# EAGLE design power_NAND_2input (EAGLE 8.6.3)
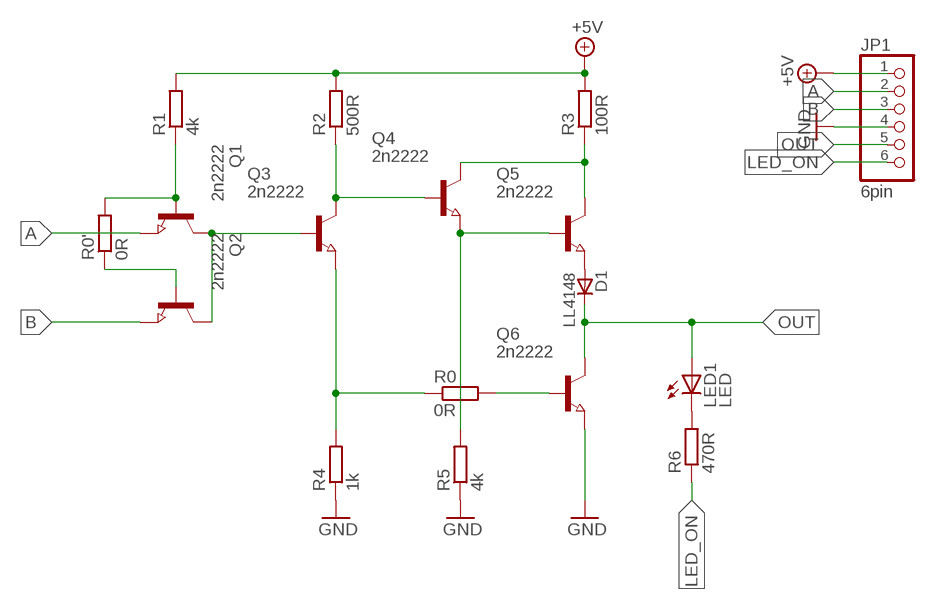
[diagram p0: schematic, sheet 1]

## Parts
D1  LL4148  [SOD80_DO213AA_MINIMELF]
JP1  6pin  PINHD-1X06_2.54-SMD-90°  [1X06SMD/90]
LED1  LED  LEDCHIPLED_0805  [CHIPLED_0805]
Q1  2n2222  NPN-TRANSISTOR_SOT23  [SOT23]
Q2  2n2222  NPN-TRANSISTOR_SOT23  [SOT23]
Q3  2n2222  NPN-TRANSISTOR_SOT23  [SOT23]
Q4  2n2222  NPN-TRANSISTOR_SOT23  [SOT23]
Q5  2n2222  NPN-TRANSISTOR_SOT23  [SOT23]
Q6  2n2222  NPN-TRANSISTOR_SOT23  [SOT23]
R0  0R  R-EU_R1206  [R1206]
R0'  0R  R-EU_R1206  [R1206]
R1  4k  R-EU_R0805  [R0805]
R2  500R  R-EU_R0805  [R0805]
R3  100R  R-EU_R0805  [R0805]
R4  1k  R-EU_R0805  [R0805]
R5  4k  R-EU_R0805  [R0805]
R6  470R  R-EU_R0805  [R0805]

## Nets
+5V: JP1.1 R1.2 R2.2 R3.2
A: JP1.2 Q1.2(E)
B: JP1.3 Q2.2(E)
GND: JP1.4 Q6.2(E) R4.1 R5.1
LED_ON: JP1.6 R6.1
N$1: Q1.3(C) Q2.3(C) Q3.1(B)
N$2: Q1.1(B) R0'.2 R1.1
N$3: Q3.3(C) Q4.1(B) R2.1
N$4: Q3.2(E) R0.1 R4.2
N$5: Q4.3(C) Q5.3(C) R3.1
N$6: Q4.2(E) Q5.1(B) R5.2
N$7: D1.A Q5.2(E)
N$8: Q2.1(B) R0'.1
N$10: LED1.C R6.2
N$11: Q6.1(B) R0.2
OUT: D1.C JP1.5 LED1.A Q6.3(C)

## Library data of the parts
D1 = _hhn_diodes_smd:LL4148: 1N4148 General Purpose Rectifie SMD-Version of 1N4148 Case: SOD 80 = DO 213 AA = MINIMELF (Glass) Author: Dipl.-Ing. FH Rainer Bayer HHN Hochschule Heilbronn, rainer.bayer@hs-heilbronn.de Ingenieurbüro ing-rb, mail@ing-rb.de
JP1 = pinhead-2:PINHD-1X06: PIN HEADER
LED1 = led:LED: LED OSRAM: - CHIPLED LG R971, LG N971, LY N971, LG Q971, LY Q971, LO R971, LY R971 LH N974, LH R974 LS Q976, LO Q976, LY Q976 LO Q996 - Hyper CHIPLED LW Q18S LB Q993, LB Q99A, LB R99A - SideLED LS A670, LO A670, LY A670, LG A670, LP A670 LB A673, LV A673, LT A673, LW A673 LH A674 LY A675 LS A676, LA A676, LO A676, LY A676, LW A676 LS A679, LY A679, LG A679 - Hyper Micro SIDELED® LS Y876, LA Y876, LO Y876, LY Y876 LT Y87S - SmartLED LW L88C, LW L88S LB L89C, LB L89S, LG L890 LS L89K, LO L89K, LY L89K LS L896, LA L896, LO L896, LY L896 - TOPLED LS T670, LO T670, LY T670, LG T670, LP T670 LSG T670, LSP T670, LSY T670, LOP T670, LYG T670 LG T671, LOG T671, LSG T671 LB T673, LV T673, LT T673, LW T673 LH T674 LS T676, LA T676, LO T676, LY T676, LB T676, LH T676, LSB T676, LW T676 LB T67C, LV T67C, LT T67C, LS T67K, LO T67K, LY T67K, LW E67C LS E67B, LA E67B, LO E67B, LY E67B, LB E67C, LV E67C, LT E67C LW T67C LS T679, LY T679, LG T679 LS T770, LO T770, LY T770, LG T770, LP T770 LB T773, LV T773, LT T773, LW T773 LH T774 LS E675, LA E675, LY E675, LS T675 LS T776, LA T776, LO T776, LY T776, LB T776 LHGB T686 LT T68C, LB T68C - Hyper Mini TOPLED® LB M676 - Mini TOPLED Santana® LG M470 LS M47K, LO M47K, LY M47K Source: http://www.osram.convergy.de LUXEON: - LUMILED® LXK2-PW12-R00, LXK2-PW12-S00, LXK2-PW14-U00, LXK2-PW14-V00 LXK2-PM12-R00, LXK2-PM12-S00, LXK2-PM14-U00 LXK2-PE12-Q00, LXK2-PE12-R00, LXK2-PE12-S00, LXK2-PE14-T00, LXK2-PE14-U00 LXK2-PB12-K00, LXK2-PB12-L00, LXK2-PB12-M00, LXK2-PB14-N00, LXK2-PB14-P00, LXK2-PB14-Q00 LXK2-PR12-L00, LXK2-PR12-M00, LXK2-PR14-Q00, LXK2-PR14-R00 LXK2-PD12-Q00, LXK2-PD12-R00, LXK2-PD12-S00 LXK2-PH12-R00, LXK2-PH12-S00 LXK2-PL12-P00, LXK2-PL12-Q00, LXK2-PL12-R00 Source: www.luxeon.com KINGBRIGHT: KA-3528ASYC Source: www.kingbright.com
Q1-Q6 = semicon-smd-ipc:NPN-TRANSISTOR_: NPN TRANSISTOR
R0 R0' R1-R6 = rcl:R-EU_: RESISTOR, European symbol; SPICEPREFIX: R

## Board
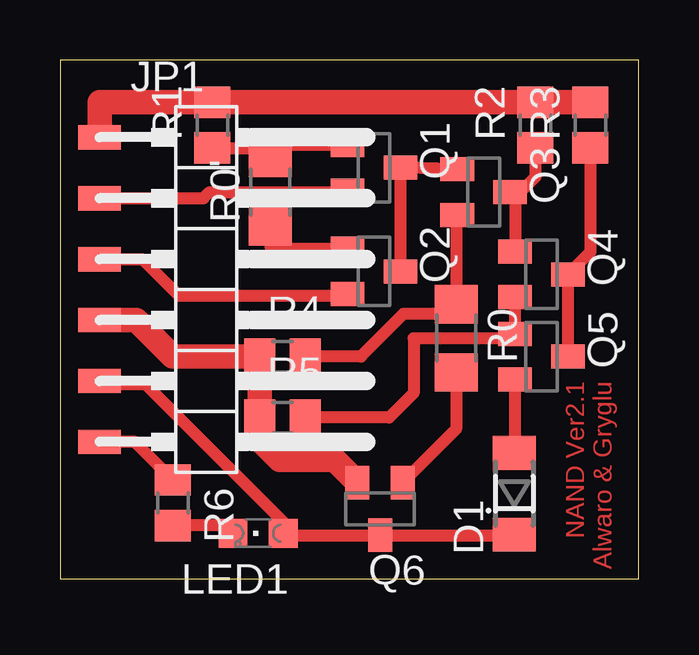
[diagram p1: board, top side]

Size 24.11 x 21.64 mm. Coordinates in mm from the lower left corner, seen from the top.
Outline: 0,0 24.11,0 24.11,21.64 0,21.64 0,0
Copper layers (1*16): Top 0.035mm / dielectric 1.5mm / Bottom 0.035mm
Design rules "default *": minimum track width 20mil, minimum drill 0.35mm, track to track 20mil, track to pad 20mil, pad to pad 20mil, via to via 20mil, smd to smd 20mil, copper to edge 40mil, drill to drill 6mil, minimum pad ring 10mil, minimum via ring 8mil, stop-mask expansion 4mil, vias tented up to drill 0mil, thermal gap 10mil

### Footprints (pad centres in the part's own frame; a part is rotated, then mirrored left to right if it is on the bottom)
SOD80_DO213AA_MINIMELF = smd 1.4 x 1.8: A 1.7,0; C -1.7,0
1X06SMD/90 = smd 1.016 x 1.778: 1 -1.27,-5.08; 2 1.27,-5.08; 3 3.81,-5.08; 4 6.35,-5.08; 5 8.89,-5.08; 6 11.43,-5.08
CHIPLED_0805 = smd 1.2 x 1.2: A 0,-1.05; C 0,1.05
SOT23 = smd 1 x 1.4: 1 -0.95,-1.1; 2 0.95,-1.1; 3 0,1.1
R1206 = smd 1.6 x 1.803: 1 -1.422,0; 2 1.422,0
R0805 = smd 1.3 x 1.5: 1 -0.95,0; 2 0.95,0

### Placement (x,y rotation side)
D1  18.92,3.56 90 top
JP1  6.73,17.14 270 top
LED1  8.26,1.91 90 top
Q1  13.08,17.14 270 top
Q2  13.08,12.83 270 top
Q3  17.65,16.13 270 top
Q4  20.07,12.7 270 top
Q5  20.07,9.27 270 top
Q6  13.34,2.92 180 top
R0  16.51,10.03 270 top
R0'  8.76,16.13 90 top
R1  6.35,18.92 90 top
R2  19.81,18.92 90 top
R3  22.1,18.92 90 top
R4  9.27,9.27 0 top
R5  9.27,6.73 0 top
R6  4.7,3.17 270 top

### Tracks (layer width: path | path; a pad name or v marks a point on that pad's centre or on a via)
+5V
  Top 1.016: JP1.1 1.65,19.87 R1.2 R2.2 R3.2
A
  Top 0.508: JP1.2 5.97,15.88 6.22,16.13 11.91,16.13 Q1.2
B
  Top 0.508: JP1.3 3.43,13.33 4.95,11.81 11.91,11.81 Q2.2
GND
  Top 1.016: JP1.4 3.18,10.8 4.7,9.27 R4.1 R5.1 8.32,5.79 9.15,4.96 11.44,4.96 Q6.2
LED_ON
  Top 0.508: R6.1 3.11,5.72 JP1.6
N$1
  Top 0.508: 16.49,17.14 Q3.1 Q1.3 Q2.3
N$2
  Top 0.508: Q1.1 9.31,18.09 8.94,17.73 | 8.94,17.73 R0'.2 | R1.1 8.7,17.97 8.94,17.73
N$3
  Top 0.508: 18.8,16.17 Q3.3 arc-90 18.97,15.92 | 18.97,15.92 Q4.1 | R2.1 19.81,16.76 18.97,15.92
N$4
  Top 0.508: 16.64,15.09 Q3.2 arc90 16.51,15.14 R0.1 16.1,11.05 14.31,11.05 12.53,9.27 R4.2
N$5
  Top 0.508: Q5.3 Q4.3 22.1,13.63 R3.1
N$6
  Top 0.508: Q4.2 Q5.1 arc-90 18.78,10.03 14.73,10.03 14.73,7.75 13.72,6.73 R5.2
N$7
  Top 0.508: D1.A 18.97,5.3 Q5.2
N$8
  Top 0.508: R0'.1 8.76,13.84 8.83,13.78 Q2.1
N$10
  Top 0.508: LED1.C 6.89,2.23 R6.2
N$11
  Top 0.508: R0.2 16.51,6.25 Q6.1
OUT
  Top 0.508: D1.C 18.89,1.82 Q6.3 9.39,1.82 LED1.A 9.3,2.38 3.56,8.13 1.78,8.13 JP1.5

### Text on the board
Top: NAND Ver2.1 / Alwaro & Gryglu